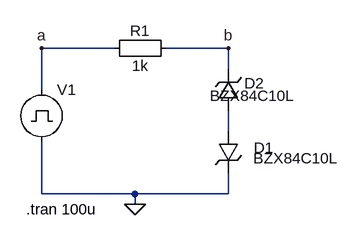
[diagram p0: schematic clipper_series_bipolar.asc]
clipper_series_bipolar.asc, the LTspice schematic file:
Version 4
SHEET 1 880 680
WIRE 16 112 -96 112
WIRE 192 112 96 112
WIRE 192 144 192 112
WIRE -96 176 -96 112
WIRE 192 240 192 208
WIRE -96 336 -96 256
WIRE 48 336 -96 336
WIRE 192 336 192 304
WIRE 192 336 48 336
WIRE 48 352 48 336
FLAG -96 112 a
FLAG 192 112 b
FLAG 48 352 0
SYMBOL zener 176 240 R0
WINDOW 0 55 25 Left 2
WINDOW 3 54 41 Left 2
SYMATTR InstName D1
SYMATTR Value BZX84C10L
SYMATTR Description Diode
SYMATTR Type diode
SYMBOL Misc\\EuropeanResistor 112 96 R90
WINDOW 0 5 56 VBottom 2
WINDOW 3 27 56 VTop 2
SYMATTR InstName R1
SYMATTR Value 1k
SYMBOL zener 208 208 R180
WINDOW 0 -39 42 Left 2
WINDOW 3 -87 23 Left 2
SYMATTR InstName D2
SYMATTR Value BZX84C10L
SYMATTR Description Diode
SYMATTR Type diode
SYMBOL pulse -96 160 R0
WINDOW 3 24 96 Invisible 2
WINDOW 123 0 0 Left 2
WINDOW 39 0 0 Left 2
SYMATTR Value PULSE(-13 13 5u 1u 1u 20u 50u)
SYMATTR InstName V1
TEXT -120 360 Left 2 !.tran 100u

The netlist it stands for:
* clipper_series_bipolar.asc
D1 N001 0 BZX84C10L
R1 b a 1k
D2 N001 b BZX84C10L
V1 a 0 PULSE(-13 13 5u 1u 1u 20u 50u)
.model D D
.lib standard.dio
.tran 100u
.backanno
.end